# Altium schematic sheet LCD_SRAM.SchDoc
size A4
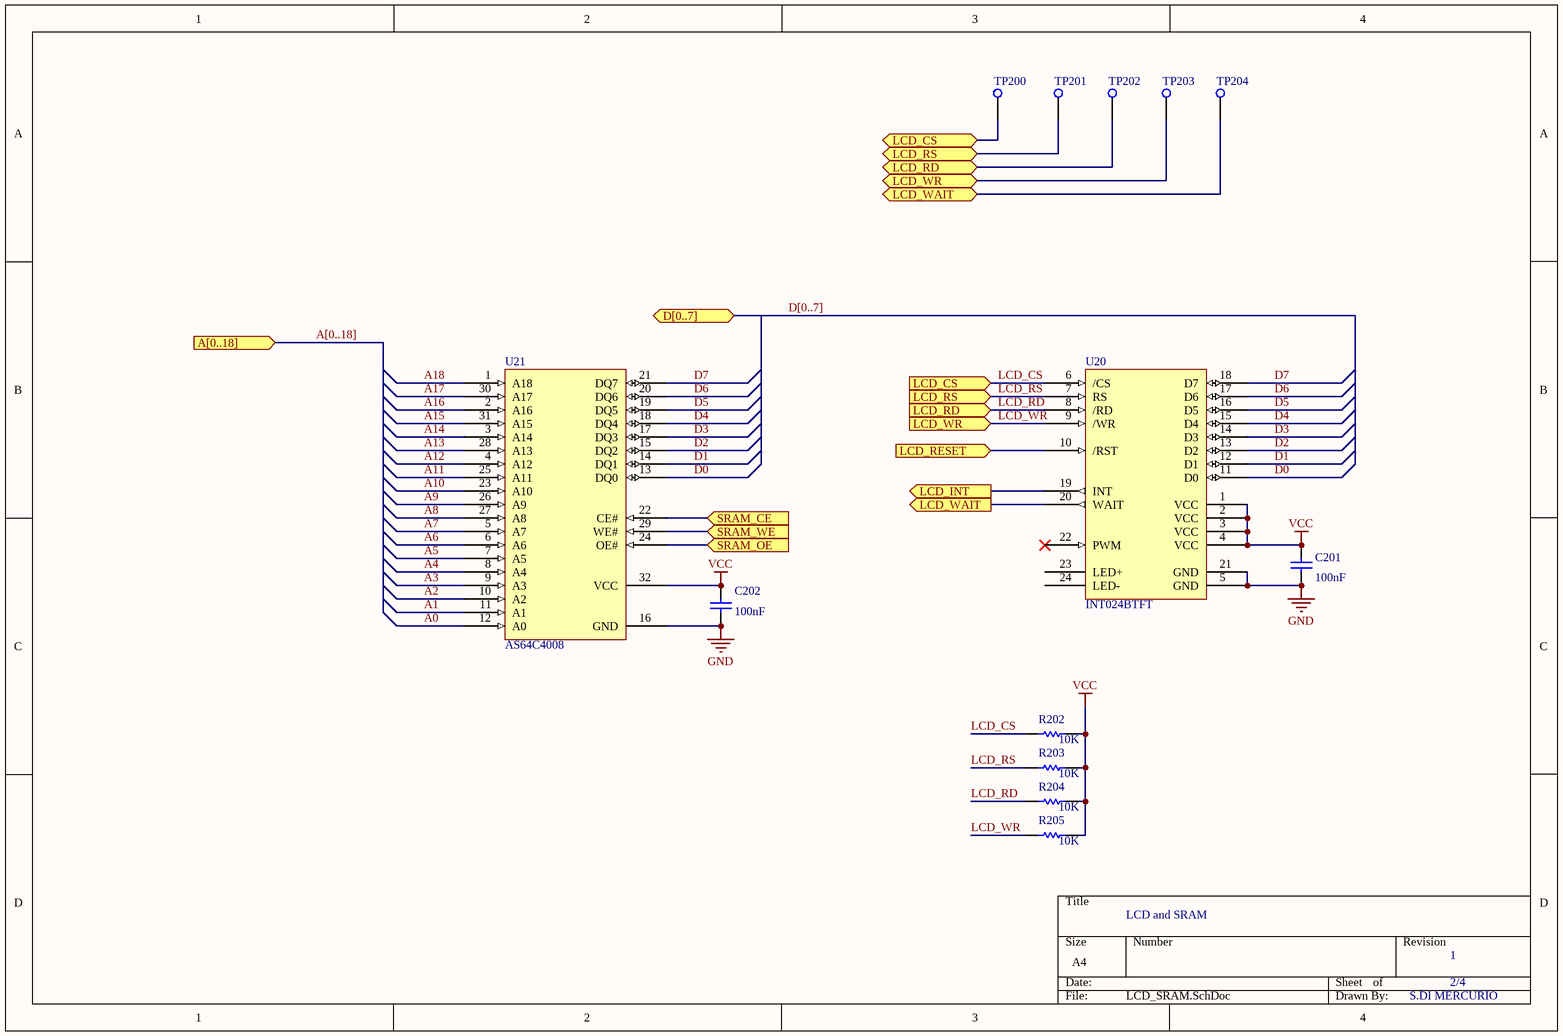
[diagram p0: LCD_SRAM.SchDoc]

## Parts
C201  value 100nF  [CAPC1206(3216)100_N]  (hidden comment: CAP 100nF 16V 1206(3216))
C202  value 100nF  [CAPC1206(3216)100_N]  (hidden comment: CAP 100nF 16V 1206(3216))
R202  10K  [RESC1206(3216)_L]
R203  10K  [RESC1206(3216)_L]
R204  10K  [RESC1206(3216)_L]
R205  10K  [RESC1206(3216)_L]
TP200  TestPoint  [TP1]  (value not drawn)
TP201  TestPoint  [TP1]  (value not drawn)
TP202  TestPoint  [TP1]  (value not drawn)
TP203  TestPoint  [TP1]  (value not drawn)
TP204  TestPoint  [TP1]  (value not drawn)
U20  INT024BTFT  [INT024BTFT]
U21  AS64C4008  [SOP32]

## Ports
A[0..18] (in), D[0..7], LCD_CS, LCD_CS (in), LCD_INT (out), LCD_RD, LCD_RD (in), LCD_RESET (in), LCD_RS, LCD_RS (in), LCD_WAIT, LCD_WAIT (out), LCD_WR, LCD_WR (in), SRAM_CE (in), SRAM_OE (in), SRAM_WE (in)

## Nets
GND: C201.2 C202.2 U20.5(GND) U20.21(GND) U21.16(GND)
VCC: C201.1 C202.1 R202.1 R203.1 R204.1 R205.1 U20.1(VCC) U20.2(VCC) U20.3(VCC) U20.4(VCC) U21.32(VCC)
A0: U21.12(A0)
A1: U21.11(A1)
A2: U21.10(A2)
A3: U21.9(A3)
A4: U21.8(A4)
A5: U21.7(A5)
A6: U21.6(A6)
A7: U21.5(A7)
A8: U21.27(A8)
A9: U21.26(A9)
A10: U21.23(A10)
A11: U21.25(A11)
A12: U21.4(A12)
A13: U21.28(A13)
A14: U21.3(A14)
A15: U21.31(A15)
A16: U21.2(A16)
A17: U21.30(A17)
A18: U21.1(A18)
D0: U20.11(D0) U21.13(DQ0)
D1: U20.12(D1) U21.14(DQ1)
D2: U20.13(D2) U21.15(DQ2)
D3: U20.14(D3) U21.17(DQ3)
D4: U20.15(D4) U21.18(DQ4)
D5: U20.16(D5) U21.19(DQ5)
D6: U20.17(D6) U21.20(DQ6)
D7: U20.18(D7) U21.21(DQ7)
LCD_CS: R202.2 TP200.1 U20.6(/CS) ; port LCD_CS
LCD_INT: U20.19(INT) ; port LCD_INT
LCD_RD: R204.2 TP202.1 U20.8(/RD) ; port LCD_RD
LCD_RESET: U20.10(/RST) ; port LCD_RESET
LCD_RS: R203.2 TP201.1 U20.7(RS) ; port LCD_RS
LCD_WAIT: TP204.1 U20.20(WAIT) ; port LCD_WAIT
LCD_WR: R205.2 TP203.1 U20.9(/WR) ; port LCD_WR
SRAM_CE: U21.22(CE#) ; port SRAM_CE
SRAM_OE: U21.24(OE#) ; port SRAM_OE
SRAM_WE: U21.29(WE#) ; port SRAM_WE

Not connected (* = marked no-connect by the designer): U20 22(PWM)* 23(LED+) 24(LED-)

## Buses and harness runs
bus A[0..18] = port A[0..18]
bus D[0..7] = port D[0..7]

## Notes on the sheet
- LCD and SRAM
- 1
- 2/4
- S.DI MERCURIO

## Library data of the parts
C201 C202 = CMP-1037-04185-1: CAP 100nF 16V -20% to +80% 1206 (3216 Metric) Thickness 1mm SMD; Case-EIA: 1206; Case-Metric: 3216; Max Thickness: 1 mm; Tolerance: -20% to +80%; Technology: SMT; Rated Voltage: 16 V
R202-R205 = CMP-1014-00623-1: 10K 0.25W 1% 1206 (3216 Metric)  SMD; Case-Metric: 3216; Case-EIA: 1206; Power: 0.25 W; Technology: SMT; Value: 10K; Tolerance: 1 %
TP200-TP204 = TestPoint: TestPoint SMD
U20 = LCD INT024BTFT
U21 = AS64C4008: SRAM 4Mbits 512K*8Bits 55 ns